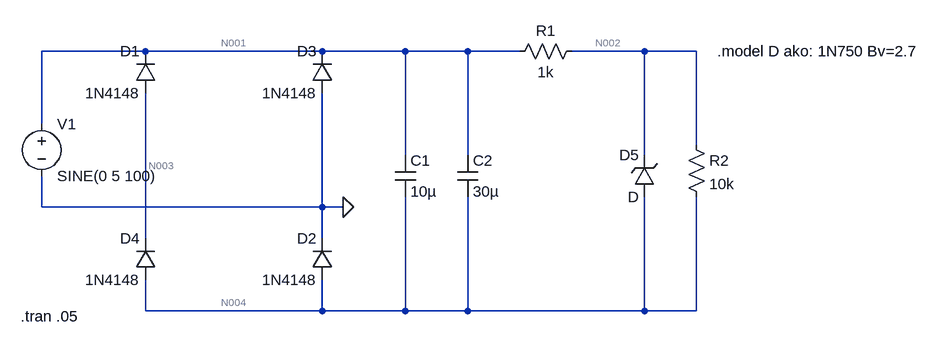
[diagram p0: schematic 1_4_3.asc]
1_4_3.asc, the LTspice schematic file:
Version 4
SHEET 1 1392 680
WIRE 176 16 16 16
WIRE 448 16 176 16
WIRE 576 16 448 16
WIRE 672 16 576 16
WIRE 752 16 672 16
WIRE 944 16 832 16
WIRE 1024 16 944 16
WIRE 16 128 16 16
WIRE 1024 160 1024 16
WIRE 576 176 576 16
WIRE 672 176 672 16
WIRE 944 176 944 16
WIRE 16 256 16 208
WIRE 448 256 448 80
WIRE 448 256 16 256
WIRE 480 256 448 256
WIRE 176 304 176 80
WIRE 448 304 448 256
WIRE 176 416 176 368
WIRE 448 416 448 368
WIRE 448 416 176 416
WIRE 576 416 576 240
WIRE 576 416 448 416
WIRE 672 416 672 240
WIRE 672 416 576 416
WIRE 944 416 944 240
WIRE 944 416 672 416
WIRE 1024 416 1024 240
WIRE 1024 416 944 416
FLAG 480 256 0
SYMBOL voltage 16 112 R0
WINDOW 123 0 0 Left 0
WINDOW 39 0 0 Left 0
SYMATTR InstName V1
SYMATTR Value SINE(0 5 100)
SYMBOL diode 192 80 R180
WINDOW 0 24 64 Left 2
WINDOW 3 24 0 Left 2
SYMATTR InstName D1
SYMATTR Value 1N4148
SYMBOL diode 464 80 R180
WINDOW 0 24 64 Left 2
WINDOW 3 24 0 Left 2
SYMATTR InstName D3
SYMATTR Value 1N4148
SYMBOL diode 192 368 R180
WINDOW 0 24 64 Left 2
WINDOW 3 24 0 Left 2
SYMATTR InstName D4
SYMATTR Value 1N4148
SYMBOL diode 464 368 R180
WINDOW 0 24 64 Left 2
WINDOW 3 24 0 Left 2
SYMATTR InstName D2
SYMATTR Value 1N4148
SYMBOL cap 560 176 R0
SYMATTR InstName C1
SYMATTR Value 10µ
SYMBOL cap 656 176 R0
SYMATTR InstName C2
SYMATTR Value 30µ
SYMBOL res 848 0 R90
WINDOW 0 0 56 VBottom 2
WINDOW 3 32 56 VTop 2
SYMATTR InstName R1
SYMATTR Value 1k
SYMBOL res 1008 144 R0
SYMATTR InstName R2
SYMATTR Value 10k
SYMBOL zener 960 240 R180
WINDOW 0 24 64 Left 2
WINDOW 3 24 0 Left 2
SYMATTR InstName D5
TEXT -16 424 Left 2 !.tran .05
TEXT 1056 16 Left 2 !.model D ako: 1N750 Bv=2.7

The netlist it stands for:
* 1_4_3.asc
V1 N001 0 SINE(0 5 100)
D1 N003 N001 1N4148
D3 0 N001 1N4148
D4 N004 N003 1N4148
D2 N004 0 1N4148
C1 N001 N004 10µ
C2 N001 N004 30µ
R1 N002 N001 1k
R2 N002 N004 10k
D5 N004 N002 D
.model D D
.lib standard.dio
.tran .05
.model D ako: 1N750 Bv=2.7
.backanno
.end

* Results of the author's LTspice run, read from the files saved beside the schematic
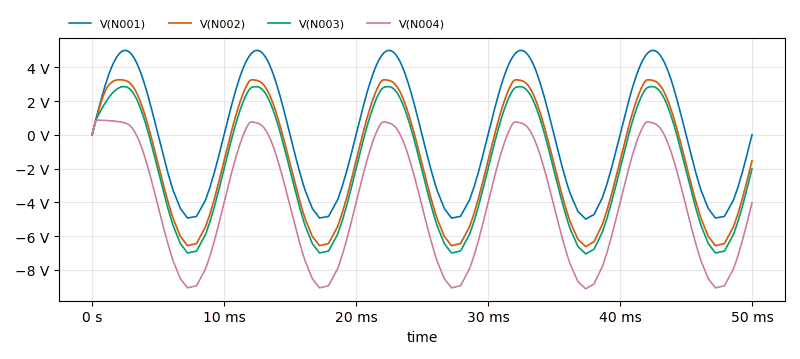
[diagram p1: Transient Analysis of 1_4_3.asc, plotted from the saved traces]
* Transient Analysis, 1 run:
*   V(N001): min -4.99 V, max 5 V, average 14.85 mV, rms 3.522 V, last 0 V
*   V(N002): min -6.618 V, max 3.263 V, average -1.585 V, rms 3.875 V, last -1.538 V
*   V(N003): min -7.053 V, max 2.856 V, average -2.015 V, rms 4.074 V, last -2.013 V
*   V(N004): min -9.118 V, max 870 mV, average -4.044 V, rms 5.401 V, last -4.026 V